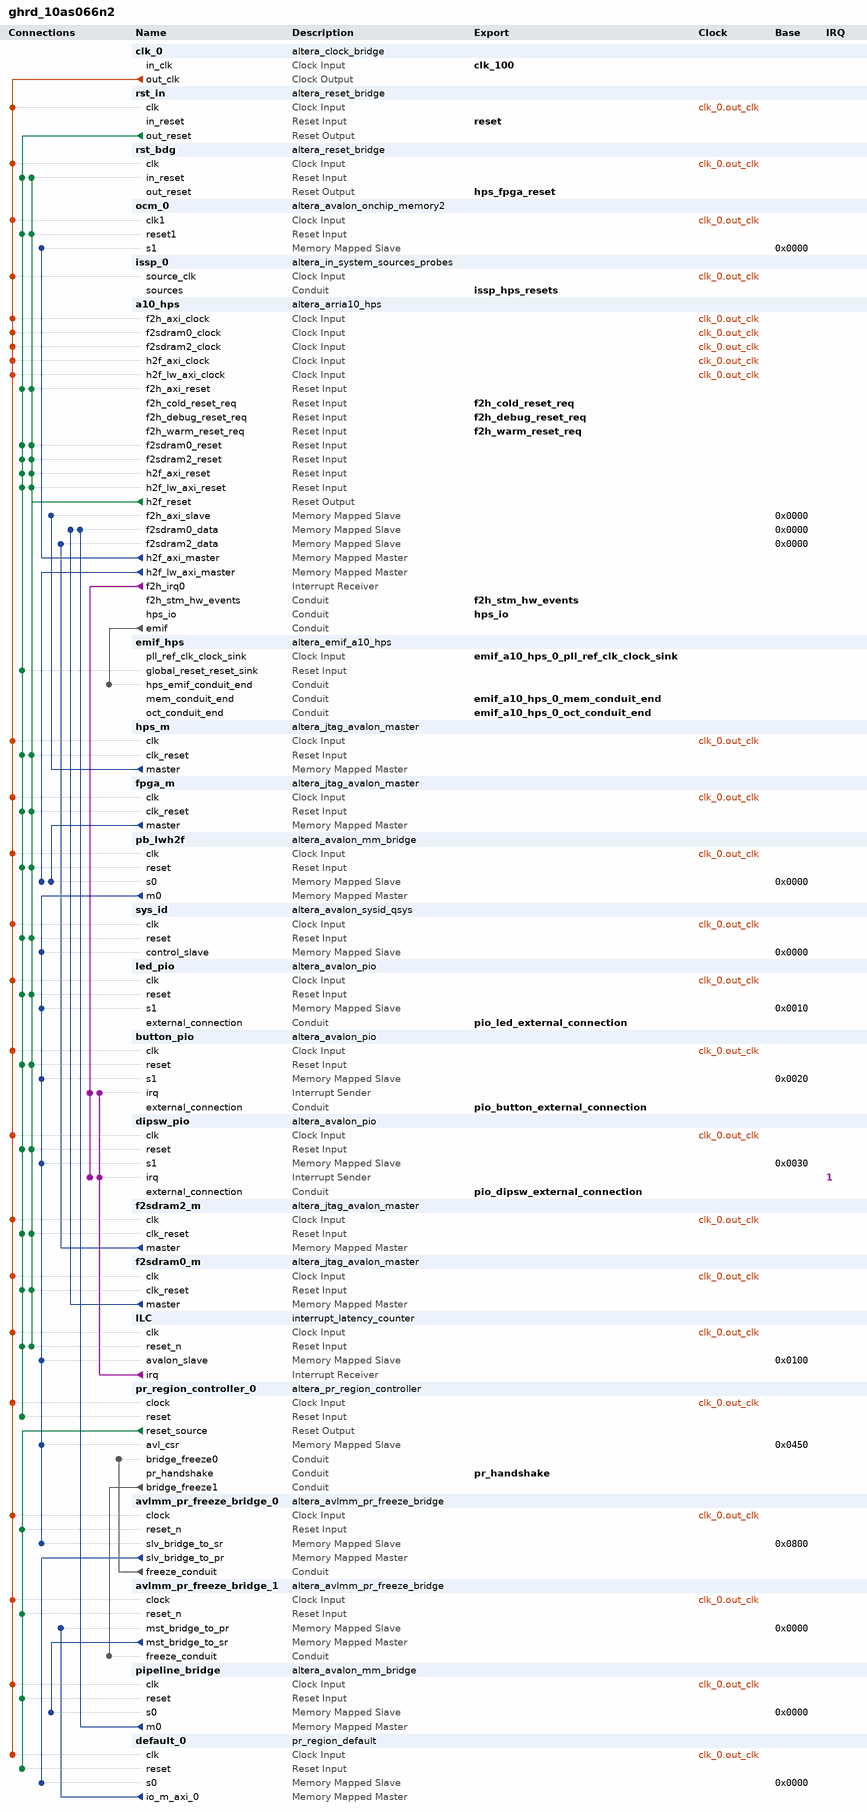
[diagram p0: system contents]
# Platform Designer (Qsys) system ghrd_10as066n2, Arria 10 10AS066N3F40E2SG
# Parameters at their usual value, and those the tool derives, are not listed.
package require -exact qsys 1.0
create_system ghrd_10as066n2
set_project_property DEVICE_FAMILY {Arria 10}
set_project_property DEVICE 10AS066N3F40E2SG

add_component clk_0 ip/ghrd_10as066n2/ghrd_10as066n2_clk_0.ip altera_clock_bridge clk_0 17.1

add_component rst_in ip/ghrd_10as066n2/ghrd_10as066n2_rst_in.ip altera_reset_bridge rst_in 17.1
load_component rst_in
set_component_parameter_value ACTIVE_LOW_RESET 1
set_component_parameter_value SYNCHRONOUS_EDGES deassert
save_component

add_component rst_bdg ip/ghrd_10as066n2/ghrd_10as066n2_rst_bdg.ip altera_reset_bridge rst_bdg 17.1

add_component ocm_0 ip/ghrd_10as066n2/ghrd_10as066n2_ocm_0.ip altera_avalon_onchip_memory2 ocm_0 17.1
load_component ocm_0
set_component_parameter_value dataWidth 8
set_component_parameter_value dualPort false
set_component_parameter_value initMemContent true
set_component_parameter_value initializationFileName onchip_mem.hex
set_component_parameter_value memorySize 262144
set_component_parameter_value singleClockOperation true
save_component

add_component issp_0 ip/ghrd_10as066n2/ghrd_10as066n2_issp_0.ip altera_in_system_sources_probes issp_0 17.1

add_instance a10_hps altera_arria10_hps 17.1
set_instance_parameter_value a10_hps BOOT_FROM_FPGA_Enable false
set_instance_parameter_value a10_hps BSEL 1
set_instance_parameter_value a10_hps BSEL_EN false
set_instance_parameter_value a10_hps CLK_EMACA_SOURCE 1
set_instance_parameter_value a10_hps CLK_EMACB_SOURCE 1
set_instance_parameter_value a10_hps CLK_EMAC_PTP_SOURCE 1
set_instance_parameter_value a10_hps CLK_GPIO_SOURCE 1
set_instance_parameter_value a10_hps CLK_HMC_PLL_SOURCE 0
set_instance_parameter_value a10_hps CLK_MAIN_PLL_SOURCE2 0
set_instance_parameter_value a10_hps CLK_MPU_CNT 0
set_instance_parameter_value a10_hps CLK_MPU_SOURCE 0
set_instance_parameter_value a10_hps CLK_NOC_CNT 0
set_instance_parameter_value a10_hps CLK_NOC_SOURCE 0
set_instance_parameter_value a10_hps CLK_PERI_PLL_SOURCE2 0
set_instance_parameter_value a10_hps CLK_S2F_USER0_SOURCE 0
set_instance_parameter_value a10_hps CLK_S2F_USER1_SOURCE 0
set_instance_parameter_value a10_hps CLK_SDMMC_SOURCE 1
set_instance_parameter_value a10_hps CM_Mode N/A
set_instance_parameter_value a10_hps CM_PinMuxing Unused
set_instance_parameter_value a10_hps CTI_Enable false
set_instance_parameter_value a10_hps CUSTOM_MPU_CLK 1020
set_instance_parameter_value a10_hps DEBUG_APB_Enable false
set_instance_parameter_value a10_hps DISABLE_PERI_PLL false
set_instance_parameter_value a10_hps DMA_Enable No,No,No,No,No,No,No,No
set_instance_parameter_value a10_hps EMAC0_CLK 250
set_instance_parameter_value a10_hps EMAC0_Mode RGMII_with_MDIO
set_instance_parameter_value a10_hps EMAC0_PTP false
set_instance_parameter_value a10_hps EMAC0_PinMuxing IO
set_instance_parameter_value a10_hps EMAC0_SWITCH_Enable false
set_instance_parameter_value a10_hps EMAC1_CLK 250
set_instance_parameter_value a10_hps EMAC1_Mode N/A
set_instance_parameter_value a10_hps EMAC1_PTP false
set_instance_parameter_value a10_hps EMAC1_PinMuxing Unused
set_instance_parameter_value a10_hps EMAC1_SWITCH_Enable false
set_instance_parameter_value a10_hps EMAC2_CLK 250
set_instance_parameter_value a10_hps EMAC2_Mode N/A
set_instance_parameter_value a10_hps EMAC2_PTP false
set_instance_parameter_value a10_hps EMAC2_PinMuxing Unused
set_instance_parameter_value a10_hps EMAC2_SWITCH_Enable false
set_instance_parameter_value a10_hps EMAC_PTP_REF_CLK 100
set_instance_parameter_value a10_hps EMIF_BYPASS_CHECK false
set_instance_parameter_value a10_hps EMIF_CONDUIT_Enable true
set_instance_parameter_value a10_hps F2H_AXI_CLOCK_FREQ 100000000
set_instance_parameter_value a10_hps F2H_COLD_RST_Enable true
set_instance_parameter_value a10_hps F2H_DBG_RST_Enable true
set_instance_parameter_value a10_hps F2H_DELAY 3
set_instance_parameter_value a10_hps F2H_FREE_CLK_Enable false
set_instance_parameter_value a10_hps F2H_FREE_CLK_FREQ 200
set_instance_parameter_value a10_hps F2H_SDRAM0_CLOCK_FREQ 100
set_instance_parameter_value a10_hps F2H_SDRAM1_CLOCK_FREQ 100
set_instance_parameter_value a10_hps F2H_SDRAM2_CLOCK_FREQ 100
set_instance_parameter_value a10_hps F2H_SDRAM3_CLOCK_FREQ 100
set_instance_parameter_value a10_hps F2H_SDRAM4_CLOCK_FREQ 100
set_instance_parameter_value a10_hps F2H_SDRAM5_CLOCK_FREQ 100
set_instance_parameter_value a10_hps F2H_WARM_RST_Enable true
set_instance_parameter_value a10_hps F2SDRAM0_ENABLED true
set_instance_parameter_value a10_hps F2SDRAM1_ENABLED false
set_instance_parameter_value a10_hps F2SDRAM2_DELAY 4
set_instance_parameter_value a10_hps F2SDRAM2_ENABLED true
set_instance_parameter_value a10_hps F2SDRAM_ADDRESS_WIDTH 32
set_instance_parameter_value a10_hps F2SDRAM_PORT_CONFIG 6
set_instance_parameter_value a10_hps F2SDRAM_READY_LATENCY true
set_instance_parameter_value a10_hps F2SINTERRUPT_Enable true
set_instance_parameter_value a10_hps F2S_Width 6
set_instance_parameter_value a10_hps FPGA_PERIPHERAL_INPUT_CLOCK_FREQ_EMAC0_RX_CLK_IN 100
set_instance_parameter_value a10_hps FPGA_PERIPHERAL_INPUT_CLOCK_FREQ_EMAC0_TX_CLK_IN 100
set_instance_parameter_value a10_hps FPGA_PERIPHERAL_INPUT_CLOCK_FREQ_EMAC1_RX_CLK_IN 100
set_instance_parameter_value a10_hps FPGA_PERIPHERAL_INPUT_CLOCK_FREQ_EMAC1_TX_CLK_IN 100
set_instance_parameter_value a10_hps FPGA_PERIPHERAL_INPUT_CLOCK_FREQ_EMAC2_RX_CLK_IN 100
set_instance_parameter_value a10_hps FPGA_PERIPHERAL_INPUT_CLOCK_FREQ_EMAC2_TX_CLK_IN 100
set_instance_parameter_value a10_hps FPGA_PERIPHERAL_INPUT_CLOCK_FREQ_EMAC_PTP_REF_CLOCK 100
set_instance_parameter_value a10_hps FPGA_PERIPHERAL_INPUT_CLOCK_FREQ_I2C0_SCL_IN 100
set_instance_parameter_value a10_hps FPGA_PERIPHERAL_INPUT_CLOCK_FREQ_I2C1_SCL_IN 100
set_instance_parameter_value a10_hps FPGA_PERIPHERAL_INPUT_CLOCK_FREQ_I2CEMAC0_SCL_IN 100
set_instance_parameter_value a10_hps FPGA_PERIPHERAL_INPUT_CLOCK_FREQ_I2CEMAC1_SCL_IN 100
set_instance_parameter_value a10_hps FPGA_PERIPHERAL_INPUT_CLOCK_FREQ_I2CEMAC2_SCL_IN 100
set_instance_parameter_value a10_hps FPGA_PERIPHERAL_INPUT_CLOCK_FREQ_SDMMC_CLK_IN 100
set_instance_parameter_value a10_hps FPGA_PERIPHERAL_INPUT_CLOCK_FREQ_SPIS0_SCLK_IN 100
set_instance_parameter_value a10_hps FPGA_PERIPHERAL_INPUT_CLOCK_FREQ_SPIS1_SCLK_IN 100
set_instance_parameter_value a10_hps FPGA_PERIPHERAL_INPUT_CLOCK_FREQ_USB0_CLK_IN 100
set_instance_parameter_value a10_hps FPGA_PERIPHERAL_INPUT_CLOCK_FREQ_USB1_CLK_IN 100
set_instance_parameter_value a10_hps FPGA_PERIPHERAL_OUTPUT_CLOCK_FREQ_EMAC0_GTX_CLK 100
set_instance_parameter_value a10_hps FPGA_PERIPHERAL_OUTPUT_CLOCK_FREQ_EMAC0_MD_CLK 2.5
set_instance_parameter_value a10_hps FPGA_PERIPHERAL_OUTPUT_CLOCK_FREQ_EMAC1_GTX_CLK 125
set_instance_parameter_value a10_hps FPGA_PERIPHERAL_OUTPUT_CLOCK_FREQ_EMAC1_MD_CLK 2.5
set_instance_parameter_value a10_hps FPGA_PERIPHERAL_OUTPUT_CLOCK_FREQ_EMAC2_GTX_CLK 125
set_instance_parameter_value a10_hps FPGA_PERIPHERAL_OUTPUT_CLOCK_FREQ_EMAC2_MD_CLK 2.5
set_instance_parameter_value a10_hps FPGA_PERIPHERAL_OUTPUT_CLOCK_FREQ_I2C0_CLK 100
set_instance_parameter_value a10_hps FPGA_PERIPHERAL_OUTPUT_CLOCK_FREQ_I2C1_CLK 100
set_instance_parameter_value a10_hps FPGA_PERIPHERAL_OUTPUT_CLOCK_FREQ_I2CEMAC0_CLK 100
set_instance_parameter_value a10_hps FPGA_PERIPHERAL_OUTPUT_CLOCK_FREQ_I2CEMAC1_CLK 100
set_instance_parameter_value a10_hps FPGA_PERIPHERAL_OUTPUT_CLOCK_FREQ_I2CEMAC2_CLK 100
set_instance_parameter_value a10_hps FPGA_PERIPHERAL_OUTPUT_CLOCK_FREQ_QSPI_SCLK_OUT 100
set_instance_parameter_value a10_hps FPGA_PERIPHERAL_OUTPUT_CLOCK_FREQ_SDMMC_CCLK 100
set_instance_parameter_value a10_hps FPGA_PERIPHERAL_OUTPUT_CLOCK_FREQ_SPIM0_SCLK_OUT 100
set_instance_parameter_value a10_hps FPGA_PERIPHERAL_OUTPUT_CLOCK_FREQ_SPIM1_SCLK_OUT 100
set_instance_parameter_value a10_hps GPIO_REF_CLK 4
set_instance_parameter_value a10_hps GP_Enable false
set_instance_parameter_value a10_hps H2F_AXI_CLOCK_FREQ 100000000
set_instance_parameter_value a10_hps H2F_COLD_RST_Enable false
set_instance_parameter_value a10_hps H2F_CTI_CLOCK_FREQ 100
set_instance_parameter_value a10_hps H2F_DEBUG_APB_CLOCK_FREQ 100
set_instance_parameter_value a10_hps H2F_DELAY 3
set_instance_parameter_value a10_hps H2F_LW_AXI_CLOCK_FREQ 100000000
set_instance_parameter_value a10_hps H2F_LW_DELAY 3
set_instance_parameter_value a10_hps H2F_PENDING_RST_Enable false
set_instance_parameter_value a10_hps H2F_TPIU_CLOCK_IN_FREQ 100
set_instance_parameter_value a10_hps H2F_USER0_CLK_Enable false
set_instance_parameter_value a10_hps H2F_USER0_CLK_FREQ 400
set_instance_parameter_value a10_hps H2F_USER1_CLK_Enable false
set_instance_parameter_value a10_hps H2F_USER1_CLK_FREQ 400
set_instance_parameter_value a10_hps HMC_PLL_REF_CLK 800
set_instance_parameter_value a10_hps HPS_DIV_GPIO_FREQ 125
set_instance_parameter_value a10_hps HPS_IO_Enable SDMMC:D0,SDMMC:CMD,SDMMC:CCLK,SDMMC:D1,SDMMC:D2,SDMMC:D3,NONE,NONE,SDMMC:D4,SDMMC:D5,SDMMC:D6,SDMMC:D7,UART1:TX,UART1:RX,USB0:CLK,USB0:STP,USB0:DIR,USB0:DATA0,USB0:DATA1,USB0:NXT,USB0:DATA2,USB0:DATA3,USB0:DATA4,USB0:DATA5,USB0:DATA6,USB0:DATA7,EMAC0:TX_CLK,EMAC0:TX_CTL,EMAC0:RX_CLK,EMAC0:RX_CTL,EMAC0:TXD0,EMAC0:TXD1,EMAC0:RXD0,EMAC0:RXD1,EMAC0:TXD2,EMAC0:TXD3,EMAC0:RXD2,EMAC0:RXD3,SPIM1:CLK,SPIM1:MOSI,SPIM1:MISO,SPIM1:SS0_N,SPIM1:SS1_N,GPIO,NONE,NONE,NONE,NONE,MDIO0:MDIO,MDIO0:MDC,I2C1:SDA,I2C1:SCL,GPIO,TRACE:CLK,GPIO,GPIO,NONE,NONE,TRACE:D0,TRACE:D1,TRACE:D2,TRACE:D3
set_instance_parameter_value a10_hps I2C0_Mode N/A
set_instance_parameter_value a10_hps I2C0_PinMuxing Unused
set_instance_parameter_value a10_hps I2C1_Mode default
set_instance_parameter_value a10_hps I2C1_PinMuxing IO
set_instance_parameter_value a10_hps I2CEMAC0_Mode N/A
set_instance_parameter_value a10_hps I2CEMAC0_PinMuxing Unused
set_instance_parameter_value a10_hps I2CEMAC1_Mode N/A
set_instance_parameter_value a10_hps I2CEMAC1_PinMuxing Unused
set_instance_parameter_value a10_hps I2CEMAC2_Mode N/A
set_instance_parameter_value a10_hps I2CEMAC2_PinMuxing Unused
set_instance_parameter_value a10_hps INTERNAL_OSCILLATOR_ENABLE 60
set_instance_parameter_value a10_hps JTAG_Enable false
set_instance_parameter_value a10_hps L3_MAIN_FREE_CLK 200
set_instance_parameter_value a10_hps L4_SYS_FREE_CLK 1
set_instance_parameter_value a10_hps LWH2F_Enable 2
set_instance_parameter_value a10_hps MPU_CLK_VCCL 1
set_instance_parameter_value a10_hps MPU_EVENTS_Enable false
set_instance_parameter_value a10_hps NAND_Mode N/A
set_instance_parameter_value a10_hps NAND_PinMuxing Unused
set_instance_parameter_value a10_hps NOCDIV_CS_ATCLK 0
set_instance_parameter_value a10_hps NOCDIV_CS_PDBGCLK 1
set_instance_parameter_value a10_hps NOCDIV_CS_TRACECLK 1
set_instance_parameter_value a10_hps NOCDIV_L4MAINCLK 0
set_instance_parameter_value a10_hps NOCDIV_L4MPCLK 0
set_instance_parameter_value a10_hps NOCDIV_L4SPCLK 2
set_instance_parameter_value a10_hps OVERIDE_PERI_PLL false
set_instance_parameter_value a10_hps PERI_PLL_MANUAL_VCO_FREQ 2000
set_instance_parameter_value a10_hps PLL_CLK0 Unused
set_instance_parameter_value a10_hps PLL_CLK1 Unused
set_instance_parameter_value a10_hps PLL_CLK2 Unused
set_instance_parameter_value a10_hps PLL_CLK3 Unused
set_instance_parameter_value a10_hps PLL_CLK4 Unused
set_instance_parameter_value a10_hps QSPI_Mode N/A
set_instance_parameter_value a10_hps QSPI_PinMuxing Unused
set_instance_parameter_value a10_hps RUN_INTERNAL_BUILD_CHECKS 0
set_instance_parameter_value a10_hps S2FINTERRUPT_CLOCKPERIPHERAL_Enable false
set_instance_parameter_value a10_hps S2FINTERRUPT_CTI_Enable false
set_instance_parameter_value a10_hps S2FINTERRUPT_DMA_Enable false
set_instance_parameter_value a10_hps S2FINTERRUPT_EMAC0_Enable false
set_instance_parameter_value a10_hps S2FINTERRUPT_EMAC1_Enable false
set_instance_parameter_value a10_hps S2FINTERRUPT_EMAC2_Enable false
set_instance_parameter_value a10_hps S2FINTERRUPT_FPGAMANAGER_Enable false
set_instance_parameter_value a10_hps S2FINTERRUPT_GPIO_Enable false
set_instance_parameter_value a10_hps S2FINTERRUPT_HMC_Enable false
set_instance_parameter_value a10_hps S2FINTERRUPT_I2C0_Enable false
set_instance_parameter_value a10_hps S2FINTERRUPT_I2C1_Enable false
set_instance_parameter_value a10_hps S2FINTERRUPT_I2CEMAC0_Enable false
set_instance_parameter_value a10_hps S2FINTERRUPT_I2CEMAC1_Enable false
set_instance_parameter_value a10_hps S2FINTERRUPT_I2CEMAC2_Enable false
set_instance_parameter_value a10_hps S2FINTERRUPT_L4TIMER_Enable false
set_instance_parameter_value a10_hps S2FINTERRUPT_NAND_Enable false
set_instance_parameter_value a10_hps S2FINTERRUPT_QSPI_Enable false
set_instance_parameter_value a10_hps S2FINTERRUPT_SDMMC_Enable false
set_instance_parameter_value a10_hps S2FINTERRUPT_SPIM0_Enable false
set_instance_parameter_value a10_hps S2FINTERRUPT_SPIM1_Enable false
set_instance_parameter_value a10_hps S2FINTERRUPT_SPIS0_Enable false
set_instance_parameter_value a10_hps S2FINTERRUPT_SPIS1_Enable false
set_instance_parameter_value a10_hps S2FINTERRUPT_SYSTEMMANAGER_Enable false
set_instance_parameter_value a10_hps S2FINTERRUPT_SYSTIMER_Enable false
set_instance_parameter_value a10_hps S2FINTERRUPT_UART0_Enable false
set_instance_parameter_value a10_hps S2FINTERRUPT_UART1_Enable false
set_instance_parameter_value a10_hps S2FINTERRUPT_USB0_Enable false
set_instance_parameter_value a10_hps S2FINTERRUPT_USB1_Enable false
set_instance_parameter_value a10_hps S2FINTERRUPT_WATCHDOG_Enable false
set_instance_parameter_value a10_hps S2F_Width 4
set_instance_parameter_value a10_hps SDMMC_Mode 8-bit
set_instance_parameter_value a10_hps SDMMC_PinMuxing IO
set_instance_parameter_value a10_hps SDMMC_REF_CLK 200
set_instance_parameter_value a10_hps SECURITY_MODULE_Enable false
set_instance_parameter_value a10_hps SPIM0_Mode N/A
set_instance_parameter_value a10_hps SPIM0_PinMuxing Unused
set_instance_parameter_value a10_hps SPIM1_Mode Dual_slave_selects
set_instance_parameter_value a10_hps SPIM1_PinMuxing IO
set_instance_parameter_value a10_hps SPIS0_Mode N/A
set_instance_parameter_value a10_hps SPIS0_PinMuxing Unused
set_instance_parameter_value a10_hps SPIS1_Mode N/A
set_instance_parameter_value a10_hps SPIS1_PinMuxing Unused
set_instance_parameter_value a10_hps STM_Enable true
set_instance_parameter_value a10_hps TESTIOCTRL_DEBUGCLKSEL 16
set_instance_parameter_value a10_hps TESTIOCTRL_MAINCLKSEL 8
set_instance_parameter_value a10_hps TESTIOCTRL_PERICLKSEL 8
set_instance_parameter_value a10_hps TEST_Enable false
set_instance_parameter_value a10_hps TRACE_Mode default
set_instance_parameter_value a10_hps TRACE_PinMuxing IO
set_instance_parameter_value a10_hps UART0_Mode N/A
set_instance_parameter_value a10_hps UART0_PinMuxing Unused
set_instance_parameter_value a10_hps UART1_Mode No_flow_control
set_instance_parameter_value a10_hps UART1_PinMuxing IO
set_instance_parameter_value a10_hps USB0_Mode default
set_instance_parameter_value a10_hps USB0_PinMuxing IO
set_instance_parameter_value a10_hps USB1_Mode N/A
set_instance_parameter_value a10_hps USB1_PinMuxing Unused
set_instance_parameter_value a10_hps USE_DEFAULT_MPU_CLK false
set_instance_parameter_value a10_hps device_name 10AS066N3F40E2SG
set_instance_parameter_value a10_hps eosc1_clk_mhz 25.0
set_instance_parameter_value a10_hps quartus_ini_hps_ip_boot_from_fpga_ready false
set_instance_parameter_value a10_hps quartus_ini_hps_ip_enable_a10_advanced_options false
set_instance_parameter_value a10_hps quartus_ini_hps_ip_enable_jtag false
set_instance_parameter_value a10_hps quartus_ini_hps_ip_enable_sdmmc_clk_in false
set_instance_parameter_value a10_hps quartus_ini_hps_ip_enable_test_interface false
set_instance_parameter_value a10_hps quartus_ini_hps_ip_overide_f2sdram_delay false
set_instance_parameter_value a10_hps quartus_ini_hps_ip_override_sdmmc_4bit false

add_component emif_hps ip/ghrd_10as066n2/ghrd_10as066n2_emif_hps.ip altera_emif_a10_hps emif_hps 17.1

add_component hps_m ip/ghrd_10as066n2/ghrd_10as066n2_hps_m.ip altera_jtag_avalon_master hps_m 17.1

add_component fpga_m ip/ghrd_10as066n2/ghrd_10as066n2_fpga_m.ip altera_jtag_avalon_master fpga_m 17.1

add_component pb_lwh2f ip/ghrd_10as066n2/ghrd_10as066n2_pb_lwh2f.ip altera_avalon_mm_bridge pb_lwh2f 17.1

add_component sys_id ip/ghrd_10as066n2/ghrd_10as066n2_sys_id.ip altera_avalon_sysid_qsys sys_id 17.1

add_component led_pio ip/ghrd_10as066n2/ghrd_10as066n2_led_pio.ip altera_avalon_pio led_pio 17.1
load_component led_pio
set_component_parameter_value direction InOut
set_component_parameter_value width 4
save_component

add_component button_pio ip/ghrd_10as066n2/ghrd_10as066n2_button_pio.ip altera_avalon_pio button_pio 17.1
load_component button_pio
set_component_parameter_value bitClearingEdgeCapReg true
set_component_parameter_value captureEdge true
set_component_parameter_value direction Input
set_component_parameter_value edgeType FALLING
set_component_parameter_value generateIRQ true
set_component_parameter_value irqType EDGE
set_component_parameter_value width 4
save_component

add_component dipsw_pio ip/ghrd_10as066n2/ghrd_10as066n2_dipsw_pio.ip altera_avalon_pio dipsw_pio 17.1

add_component f2sdram2_m ip/ghrd_10as066n2/ghrd_10as066n2_f2sdram2_m.ip altera_jtag_avalon_master f2sdram2_m 17.1

add_component f2sdram0_m ip/ghrd_10as066n2/ghrd_10as066n2_f2sdram0_m.ip altera_jtag_avalon_master f2sdram0_m 17.1

add_component ILC ip/ghrd_10as066n2/ghrd_10as066n2_ILC.ip interrupt_latency_counter ILC 17.1

add_component pr_region_controller_0 ip/ghrd_10as066n2/ghrd_10as066n2_pr_region_controller_0.ip altera_pr_region_controller pr_region_controller_0 17.1

add_component avlmm_pr_freeze_bridge_0 ip/ghrd_10as066n2/ghrd_10as066n2_avlmm_pr_freeze_bridge_0.ip altera_avlmm_pr_freeze_bridge avlmm_pr_freeze_bridge_0 17.1

add_component avlmm_pr_freeze_bridge_1 ip/ghrd_10as066n2/ghrd_10as066n2_avlmm_pr_freeze_bridge_1.ip altera_avlmm_pr_freeze_bridge avlmm_pr_freeze_bridge_1 17.1
load_component avlmm_pr_freeze_bridge_1
set_component_parameter_value Interface_Type {Avalon-MM Master}
set_component_parameter_value ENABLE_FREEZE_FROM_PR_REGION false
set_component_parameter_value ENABLE_TRAFFIC_TRACKING false
set_component_parameter_value slv_bridge_signal_name_DERIVED address,beginbursttransfer,byteenable,debugaccess,read,write,readdata,writedata,waitrequest,readdatavalid,burstcount,response,lock,writeresponsevalid
set_component_parameter_value slv_bridge_signal_Enable Yes,Yes,Yes,Yes,Yes,Yes,Yes,Yes,Yes,Yes,Yes,Yes,Yes,Yes
set_component_parameter_value SLV_BRIDGE_ADDR_WIDTH 32
set_component_parameter_value SLV_BRIDGE_SYMBOL_WIDTH 8
set_component_parameter_value SLV_BRIDGE_BYTEEN_WIDTH 4
set_component_parameter_value SLV_BRIDGE_BURSTCOUNT_WIDTH 3
set_component_parameter_value SLV_BRIDGE_BURST_LINEWRAP true
set_component_parameter_value SLV_BRIDGE_CONSTANTBURSTBEHAVIOR true
set_component_parameter_value SLV_BRIDGE_BURST_BNDR_ONLY true
set_component_parameter_value SLV_BRIDGE_MAX_PENDING_READS 1
set_component_parameter_value SLV_BRIDGE_MAX_PENDING_WRITES 1
set_component_parameter_value SLV_BRIDGE_FIX_READ_LATENCY 0
set_component_parameter_value SLV_BRIDGE_READ_WAIT_TIME 1
set_component_parameter_value SLV_BRIDGE_WRITE_WAIT_TIME 0
set_component_parameter_value SLV_BRIDGE_ADDRESS_UNITS SYMBOLS
set_component_parameter_value mst_bridge_signal_name_DERIVED address,beginbursttransfer,byteenable,debugaccess,read,write,readdata,writedata,waitrequest,readdatavalid,burstcount,response,lock,writeresponsevalid
set_component_parameter_value mst_bridge_signal_Enable Yes,Yes,Yes,Yes,Yes,Yes,Yes,Yes,Yes,Yes,Yes,Yes,Yes,Yes
set_component_parameter_value MST_BRIDGE_ADDR_WIDTH 32
set_component_parameter_value MST_BRIDGE_SYMBOL_WIDTH 8
set_component_parameter_value MST_BRIDGE_BYTEEN_WIDTH 4
set_component_parameter_value MST_BRIDGE_BURSTCOUNT_WIDTH 3
set_component_parameter_value MST_BRIDGE_BURST_LINEWRAP true
set_component_parameter_value MST_BRIDGE_BURST_BNDR_ONLY true
set_component_parameter_value MST_BRIDGE_CONSTANTBURSTBEHAVIOR true
set_component_parameter_value MST_BRIDGE_MAX_PENDING_READS 1
set_component_parameter_value MST_BRIDGE_MAX_PENDING_WRITES 1
set_component_parameter_value MST_BRIDGE_FIX_READ_LATENCY 0
set_component_parameter_value MST_BRIDGE_READ_WAIT_TIME 1
set_component_parameter_value MST_BRIDGE_WRITE_WAIT_TIME 0
set_component_parameter_value MST_BRIDGE_ADDRESS_UNITS SYMBOLS
save_component

add_component pipeline_bridge ip/ghrd_10as066n2/ghrd_10as066n2_mm_bridge_0.ip altera_avalon_mm_bridge pipeline_bridge 17.1

add_component default_0 pr_region_default.qsys pr_region_default default_0 

# connections
add_connection clk_0.out_clk a10_hps.f2h_axi_clock clock
add_connection clk_0.out_clk a10_hps.f2sdram0_clock clock
add_connection clk_0.out_clk a10_hps.f2sdram2_clock clock
add_connection clk_0.out_clk a10_hps.h2f_axi_clock clock
add_connection clk_0.out_clk a10_hps.h2f_lw_axi_clock clock
add_connection clk_0.out_clk avlmm_pr_freeze_bridge_0.clock clock
add_connection clk_0.out_clk avlmm_pr_freeze_bridge_1.clock clock
add_connection clk_0.out_clk button_pio.clk clock
add_connection clk_0.out_clk default_0.clk clock
add_connection clk_0.out_clk dipsw_pio.clk clock
add_connection clk_0.out_clk f2sdram0_m.clk clock
add_connection clk_0.out_clk f2sdram2_m.clk clock
add_connection clk_0.out_clk fpga_m.clk clock
add_connection clk_0.out_clk hps_m.clk clock
add_connection clk_0.out_clk ILC.clk clock
add_connection clk_0.out_clk issp_0.source_clk clock
add_connection clk_0.out_clk led_pio.clk clock
add_connection clk_0.out_clk ocm_0.clk1 clock
add_connection clk_0.out_clk pb_lwh2f.clk clock
add_connection clk_0.out_clk pipeline_bridge.clk clock
add_connection clk_0.out_clk pr_region_controller_0.clock clock
add_connection clk_0.out_clk rst_bdg.clk clock
add_connection clk_0.out_clk rst_in.clk clock
add_connection clk_0.out_clk sys_id.clk clock
add_connection a10_hps.h2f_reset a10_hps.f2h_axi_reset reset
add_connection a10_hps.h2f_reset a10_hps.f2sdram0_reset reset
add_connection a10_hps.h2f_reset a10_hps.f2sdram2_reset reset
add_connection a10_hps.h2f_reset a10_hps.h2f_axi_reset reset
add_connection a10_hps.h2f_reset a10_hps.h2f_lw_axi_reset reset
add_connection a10_hps.h2f_reset button_pio.reset reset
add_connection a10_hps.h2f_reset dipsw_pio.reset reset
add_connection a10_hps.h2f_reset f2sdram0_m.clk_reset reset
add_connection a10_hps.h2f_reset f2sdram2_m.clk_reset reset
add_connection a10_hps.h2f_reset fpga_m.clk_reset reset
add_connection a10_hps.h2f_reset hps_m.clk_reset reset
add_connection a10_hps.h2f_reset ILC.reset_n reset
add_connection a10_hps.h2f_reset led_pio.reset reset
add_connection a10_hps.h2f_reset ocm_0.reset1 reset
add_connection a10_hps.h2f_reset pb_lwh2f.reset reset
add_connection a10_hps.h2f_reset rst_bdg.in_reset reset
add_connection a10_hps.h2f_reset sys_id.reset reset
add_connection pr_region_controller_0.reset_source avlmm_pr_freeze_bridge_0.reset_n reset
add_connection pr_region_controller_0.reset_source avlmm_pr_freeze_bridge_1.reset_n reset
add_connection pr_region_controller_0.reset_source default_0.reset reset
add_connection pr_region_controller_0.reset_source pipeline_bridge.reset reset
add_connection rst_in.out_reset a10_hps.f2h_axi_reset reset
add_connection rst_in.out_reset a10_hps.f2sdram0_reset reset
add_connection rst_in.out_reset a10_hps.f2sdram2_reset reset
add_connection rst_in.out_reset a10_hps.h2f_axi_reset reset
add_connection rst_in.out_reset a10_hps.h2f_lw_axi_reset reset
add_connection rst_in.out_reset button_pio.reset reset
add_connection rst_in.out_reset dipsw_pio.reset reset
add_connection rst_in.out_reset emif_hps.global_reset_reset_sink reset
add_connection rst_in.out_reset f2sdram0_m.clk_reset reset
add_connection rst_in.out_reset f2sdram2_m.clk_reset reset
add_connection rst_in.out_reset fpga_m.clk_reset reset
add_connection rst_in.out_reset hps_m.clk_reset reset
add_connection rst_in.out_reset ILC.reset_n reset
add_connection rst_in.out_reset led_pio.reset reset
add_connection rst_in.out_reset ocm_0.reset1 reset
add_connection rst_in.out_reset pb_lwh2f.reset reset
add_connection rst_in.out_reset pr_region_controller_0.reset reset
add_connection rst_in.out_reset rst_bdg.in_reset reset
add_connection rst_in.out_reset sys_id.reset reset
add_connection a10_hps.h2f_axi_master ocm_0.s1 avalon
set_connection_parameter_value a10_hps.h2f_axi_master/ocm_0.s1 baseAddress 0x0000
add_connection a10_hps.h2f_lw_axi_master pb_lwh2f.s0 avalon
set_connection_parameter_value a10_hps.h2f_lw_axi_master/pb_lwh2f.s0 baseAddress 0x0000
add_connection avlmm_pr_freeze_bridge_0.slv_bridge_to_pr default_0.s0 avalon
set_connection_parameter_value avlmm_pr_freeze_bridge_0.slv_bridge_to_pr/default_0.s0 baseAddress 0x0000
add_connection avlmm_pr_freeze_bridge_1.mst_bridge_to_sr pipeline_bridge.s0 avalon
set_connection_parameter_value avlmm_pr_freeze_bridge_1.mst_bridge_to_sr/pipeline_bridge.s0 baseAddress 0x0000
add_connection default_0.io_m_axi_0 avlmm_pr_freeze_bridge_1.mst_bridge_to_pr avalon
set_connection_parameter_value default_0.io_m_axi_0/avlmm_pr_freeze_bridge_1.mst_bridge_to_pr baseAddress 0x0000
add_connection f2sdram0_m.master a10_hps.f2sdram0_data avalon
set_connection_parameter_value f2sdram0_m.master/a10_hps.f2sdram0_data baseAddress 0x0000
add_connection f2sdram2_m.master a10_hps.f2sdram2_data avalon
set_connection_parameter_value f2sdram2_m.master/a10_hps.f2sdram2_data baseAddress 0x0000
add_connection fpga_m.master pb_lwh2f.s0 avalon
set_connection_parameter_value fpga_m.master/pb_lwh2f.s0 baseAddress 0x0000
add_connection hps_m.master a10_hps.f2h_axi_slave avalon
set_connection_parameter_value hps_m.master/a10_hps.f2h_axi_slave baseAddress 0x0000
add_connection pb_lwh2f.m0 avlmm_pr_freeze_bridge_0.slv_bridge_to_sr avalon
set_connection_parameter_value pb_lwh2f.m0/avlmm_pr_freeze_bridge_0.slv_bridge_to_sr baseAddress 0x0800
add_connection pb_lwh2f.m0 button_pio.s1 avalon
set_connection_parameter_value pb_lwh2f.m0/button_pio.s1 baseAddress 0x0020
add_connection pb_lwh2f.m0 dipsw_pio.s1 avalon
set_connection_parameter_value pb_lwh2f.m0/dipsw_pio.s1 baseAddress 0x0030
add_connection pb_lwh2f.m0 ILC.avalon_slave avalon
set_connection_parameter_value pb_lwh2f.m0/ILC.avalon_slave baseAddress 0x0100
add_connection pb_lwh2f.m0 led_pio.s1 avalon
set_connection_parameter_value pb_lwh2f.m0/led_pio.s1 baseAddress 0x0010
add_connection pb_lwh2f.m0 pr_region_controller_0.avl_csr avalon
set_connection_parameter_value pb_lwh2f.m0/pr_region_controller_0.avl_csr baseAddress 0x0450
add_connection pb_lwh2f.m0 sys_id.control_slave avalon
set_connection_parameter_value pb_lwh2f.m0/sys_id.control_slave baseAddress 0x0000
add_connection pipeline_bridge.m0 a10_hps.f2sdram0_data avalon
set_connection_parameter_value pipeline_bridge.m0/a10_hps.f2sdram0_data baseAddress 0x0000
add_connection a10_hps.emif emif_hps.hps_emif_conduit_end conduit
add_connection avlmm_pr_freeze_bridge_0.freeze_conduit pr_region_controller_0.bridge_freeze0 conduit
add_connection pr_region_controller_0.bridge_freeze1 avlmm_pr_freeze_bridge_1.freeze_conduit conduit
add_connection a10_hps.f2h_irq0 button_pio.irq interrupt
add_connection a10_hps.f2h_irq0 dipsw_pio.irq interrupt
set_connection_parameter_value a10_hps.f2h_irq0/dipsw_pio.irq irqNumber 1
add_connection ILC.irq button_pio.irq interrupt
add_connection ILC.irq dipsw_pio.irq interrupt
set_connection_parameter_value ILC.irq/dipsw_pio.irq irqNumber 1

# exported interfaces
add_interface clk_100 clock sink
set_interface_property clk_100 EXPORT_OF clk_0.in_clk
add_interface emif_a10_hps_0_mem_conduit_end conduit end
set_interface_property emif_a10_hps_0_mem_conduit_end EXPORT_OF emif_hps.mem_conduit_end
add_interface emif_a10_hps_0_oct_conduit_end conduit end
set_interface_property emif_a10_hps_0_oct_conduit_end EXPORT_OF emif_hps.oct_conduit_end
add_interface emif_a10_hps_0_pll_ref_clk_clock_sink clock sink
set_interface_property emif_a10_hps_0_pll_ref_clk_clock_sink EXPORT_OF emif_hps.pll_ref_clk_clock_sink
add_interface f2h_cold_reset_req reset sink
set_interface_property f2h_cold_reset_req EXPORT_OF a10_hps.f2h_cold_reset_req
add_interface f2h_debug_reset_req reset sink
set_interface_property f2h_debug_reset_req EXPORT_OF a10_hps.f2h_debug_reset_req
add_interface f2h_stm_hw_events conduit end
set_interface_property f2h_stm_hw_events EXPORT_OF a10_hps.f2h_stm_hw_events
add_interface f2h_warm_reset_req reset sink
set_interface_property f2h_warm_reset_req EXPORT_OF a10_hps.f2h_warm_reset_req
add_interface hps_fpga_reset reset source
set_interface_property hps_fpga_reset EXPORT_OF rst_bdg.out_reset
add_interface hps_io conduit end
set_interface_property hps_io EXPORT_OF a10_hps.hps_io
add_interface issp_hps_resets conduit end
set_interface_property issp_hps_resets EXPORT_OF issp_0.sources
add_interface pio_button_external_connection conduit end
set_interface_property pio_button_external_connection EXPORT_OF button_pio.external_connection
add_interface pio_dipsw_external_connection conduit end
set_interface_property pio_dipsw_external_connection EXPORT_OF dipsw_pio.external_connection
add_interface pio_led_external_connection conduit end
set_interface_property pio_led_external_connection EXPORT_OF led_pio.external_connection
add_interface pr_handshake conduit end
set_interface_property pr_handshake EXPORT_OF pr_region_controller_0.pr_handshake
add_interface reset reset sink
set_interface_property reset EXPORT_OF rst_in.in_reset

set_interconnect_requirement {$system} qsys_mm.burstAdapterImplementation GENERIC_CONVERTER
set_interconnect_requirement {$system} qsys_mm.clockCrossingAdapter AUTO
set_interconnect_requirement {$system} qsys_mm.enableEccProtection FALSE
set_interconnect_requirement {$system} qsys_mm.insertDefaultSlave FALSE
set_interconnect_requirement {$system} qsys_mm.maxAdditionalLatency 4
set_interconnect_requirement hps_m.master qsys_mm.security SECURE

save_system ghrd_10as066n2.qsys
